# Altium schematic sheet [4] USB-PD Controller.SchDoc: Type-C and Sink Controller
size A3; Author: Caner ALP; Organization: ALP Electronics; Address1: Axel Oxenstiernas; Address2: Västerås; Address3: 72478; Address4: Sweden; DocumentNumber: 4; Revision: P0.1; SheetNumber: 4; SheetTotal: 7
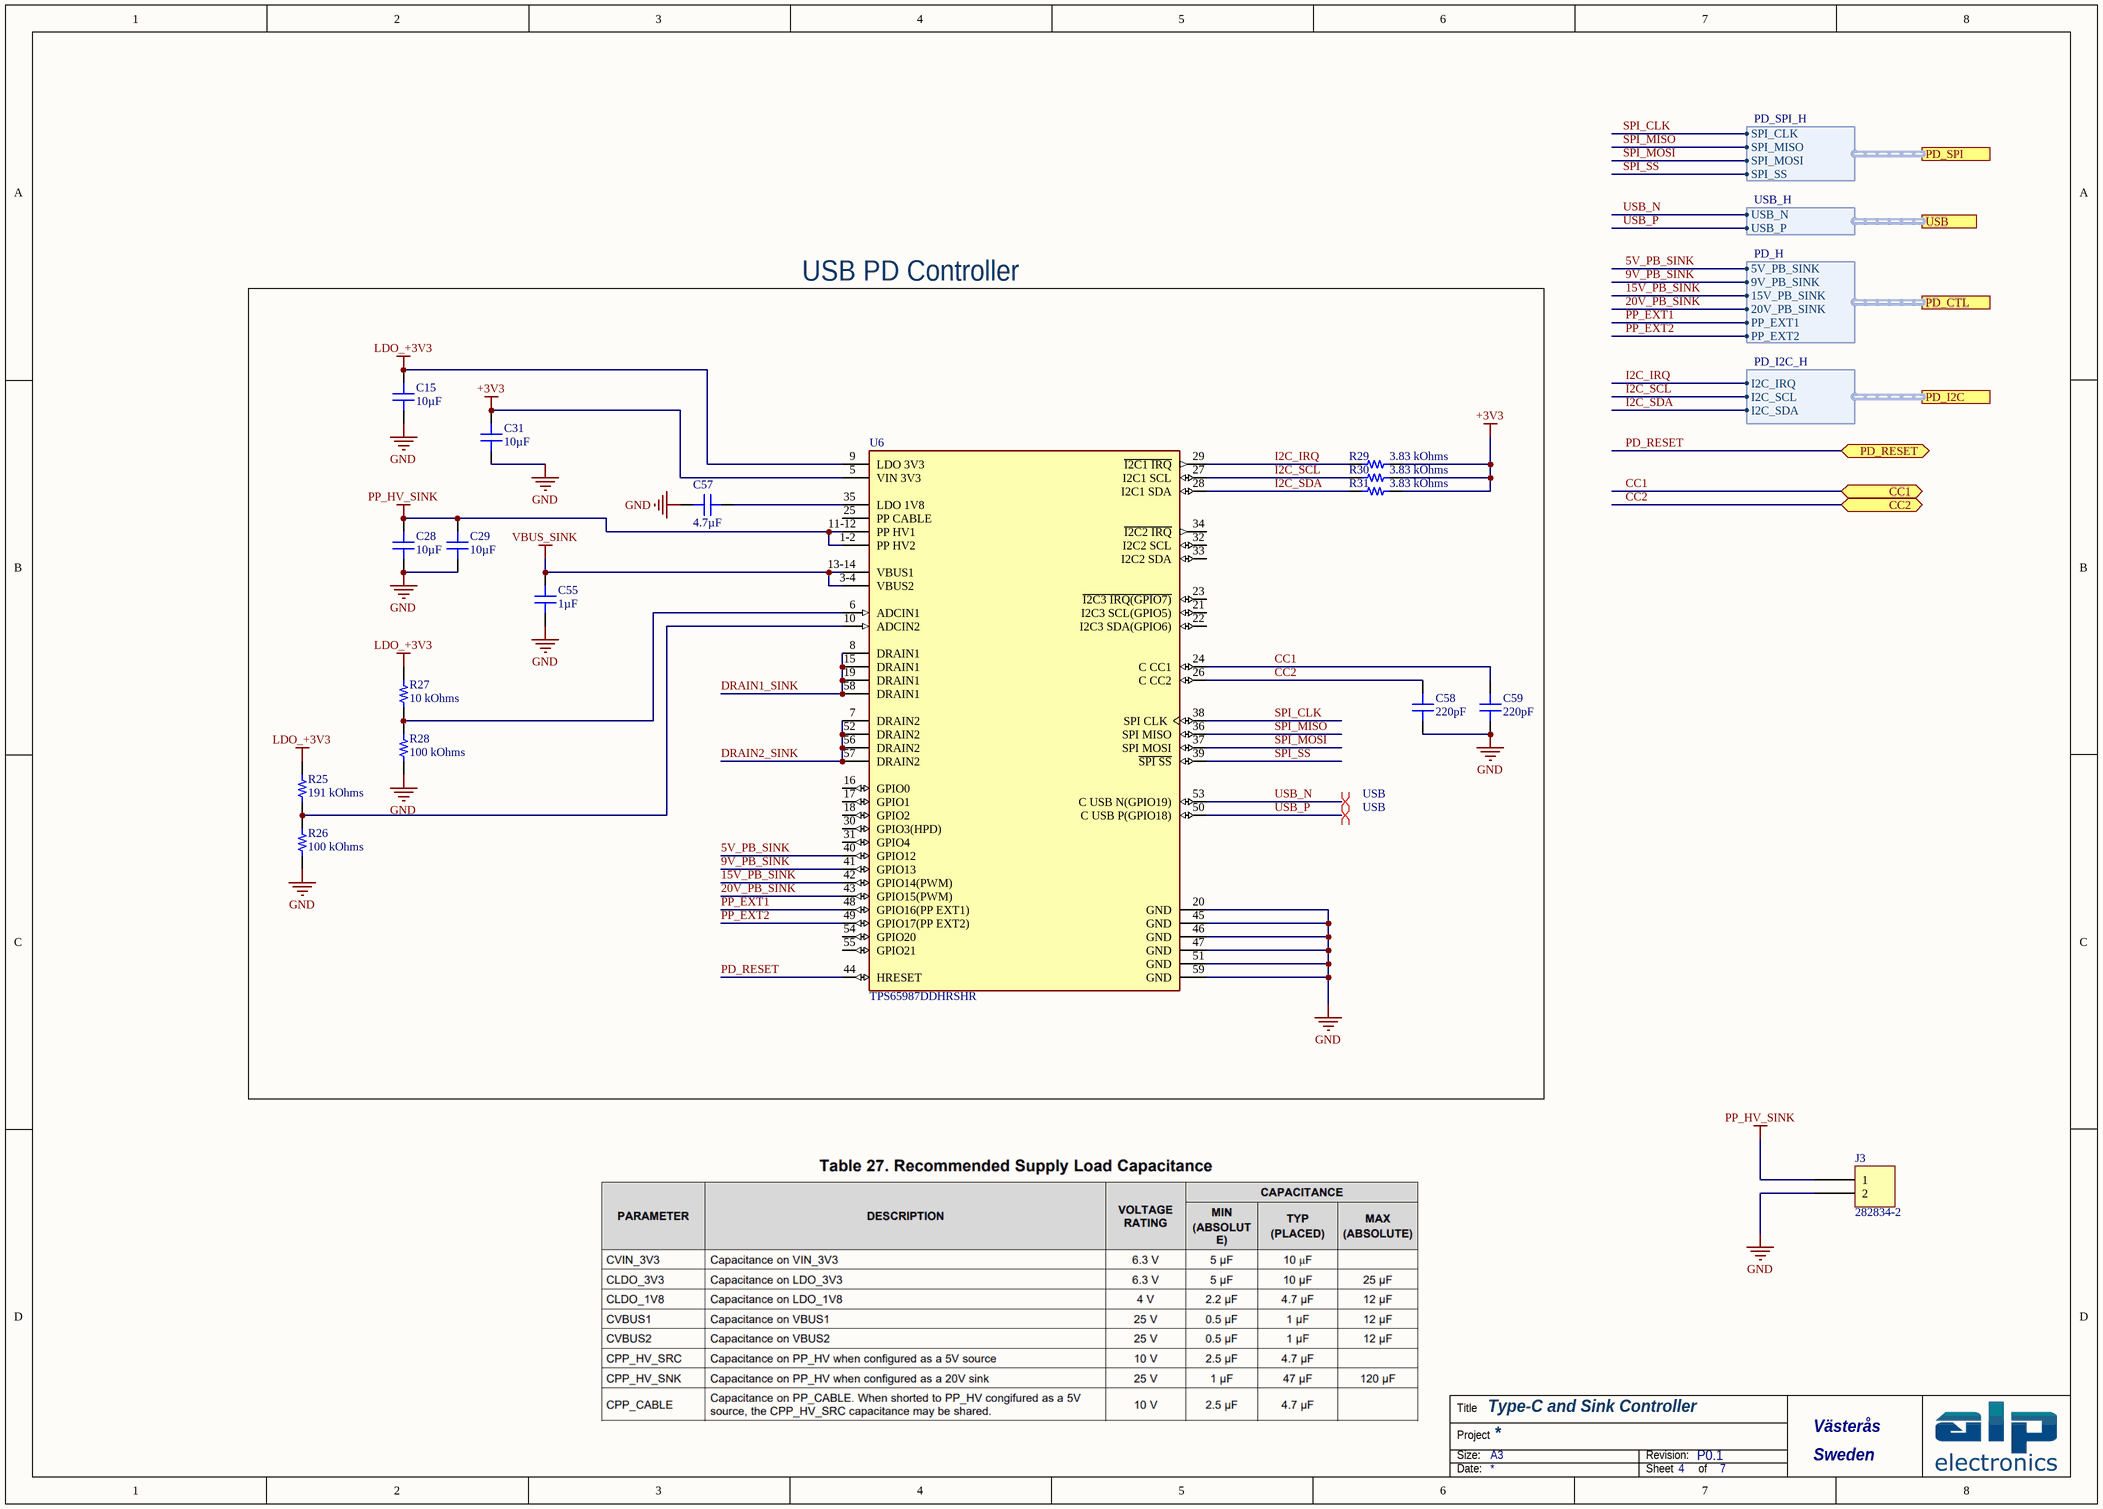
[diagram p0: [4] USB-PD Controller.SchDoc]

## Parts
C15  10µF  [CAP 0603_1608]
C28  10µF  [CAP 1206_3216 - 1.8MM]
C29  10µF  [CAP 1206_3216 - 1.8MM]
C31  10µF  [CAP 0603_1608]
C55  1µF  [CAP 1206_3216 - 0.8MM]
C57  4.7µF  [CAP 0603_1608]
C58  220pF  [CAP 0603_1608]
C59  220pF  [CAP 0603_1608]
J3  282834-2  [TE 282834-2]
R25  191 kOhms  [RES 0603_1608]
R26  100 kOhms  [RES 0603_1608]
R27  10 kOhms  [RES 0603_1608]
R28  100 kOhms  [RES 0603_1608]
R29  3.83 kOhms  [RES 0603_1608]
R30  3.83 kOhms  [RES 0603_1608]
R31  3.83 kOhms  [RES 0603_1608]
U6  TPS65987DDHRSHR  [FP-RSH0056E-MFG]

## Blocks framed on the sheet
USB PD Controller: C15 C28 C29 C31 C55 C57-C59 R25-R31 U6

## Ports
CC1 (bidir), CC2 (bidir), PD_CTL (harness PD_H), PD_I2C (harness PD_I2C_H), PD_RESET (bidir), PD_SPI (harness PD_SPI_H), USB (harness USB_H)

## Harnesses
PD_SPI_H: SPI_CLK, SPI_MISO, SPI_MOSI, SPI_SS
USB_H: USB_N, USB_P
PD_H: 5V_PB_SINK, 9V_PB_SINK, 15V_PB_SINK, 20V_PB_SINK, PP_EXT1, PP_EXT2
PD_I2C_H: I2C_IRQ, I2C_SCL, I2C_SDA

## Nets
+3V3: C31.2 R29.1 R30.1 R31.1 U6.5(VIN_3V3)
GND: C15.1 C28.1 C29.1 C31.1 C55.1 C57.2 C58.1 C59.1 J3.2 R26.1 R28.1 U6.20(GND) U6.45(GND) U6.46(GND) U6.47(GND) U6.51(GND) U6.59(GND)
LDO_+3V3: C15.2 R25.2 R27.1 U6.9(LDO_3V3)
PP_HV_SINK: C28.2 C29.2 J3.1 U6.1-2(PP_HV2) U6.11-12(PP_HV1)
VBUS_SINK: C55.2 U6.3-4(VBUS2) U6.13-14(VBUS1)
5V_PB_SINK: U6.40(GPIO12) ; port PD_CTL.5V_PB_SINK
9V_PB_SINK: U6.41(GPIO13) ; port PD_CTL.9V_PB_SINK
15V_PB_SINK: U6.42(GPIO14(PWM)) ; port PD_CTL.15V_PB_SINK
20V_PB_SINK: U6.43(GPIO15(PWM)) ; port PD_CTL.20V_PB_SINK
CC1: C59.2 U6.24(C_CC1) ; port CC1
CC2: C58.2 U6.26(C_CC2) ; port CC2
DRAIN1_SINK: U6.8(DRAIN1) U6.15(DRAIN1) U6.19(DRAIN1) U6.58(DRAIN1)
DRAIN2_SINK: U6.7(DRAIN2) U6.52(DRAIN2) U6.56(DRAIN2) U6.57(DRAIN2)
I2C_IRQ: R29.2 U6.29(~{I2C1_IRQ}) ; port PD_I2C.I2C_IRQ
I2C_SCL: R30.2 U6.27(I2C1_SCL) ; port PD_I2C.I2C_SCL
I2C_SDA: R31.2 U6.28(I2C1_SDA) ; port PD_I2C.I2C_SDA
PD_RESET: U6.44(HRESET) ; port PD_RESET
PP_EXT1: U6.48(GPIO16(PP_EXT1)) ; port PD_CTL.PP_EXT1
PP_EXT2: U6.49(GPIO17(PP_EXT2)) ; port PD_CTL.PP_EXT2
SPI_CLK: U6.38(SPI_CLK) ; port PD_SPI.SPI_CLK
SPI_MISO: U6.36(SPI_MISO) ; port PD_SPI.SPI_MISO
SPI_MOSI: U6.37(SPI_MOSI) ; port PD_SPI.SPI_MOSI
SPI_SS: U6.39(~{SPI_SS}) ; port PD_SPI.SPI_SS
USB_N: U6.53(C_USB_N(GPIO19)) ; port USB.USB_N
USB_P: U6.50(C_USB_P(GPIO18)) ; port USB.USB_P
NetC57_1: C57.1 U6.35(LDO_1V8)
NetR25_1: R25.1 R26.2 U6.10(ADCIN2)
NetR27_2: R27.2 R28.2 U6.6(ADCIN1)

Not connected (* = marked no-connect by the designer): U6 16(GPIO0) 17(GPIO1) 18(GPIO2) 21(I2C3_SCL(GPIO5)) 22(I2C3_SDA(GPIO6)) 23(~{I2C3_IRQ(GPIO7)}) 25(PP_CABLE) 30(GPIO3(HPD)) 31(GPIO4) 32(I2C2_SCL) 33(I2C2_SDA) 34(~{I2C2_IRQ}) 54(GPIO20) 55(GPIO21)

## Layout directives
differential pair; differential pair class USB: USB_N, USB_P

## Notes on the sheet
- Title
- Size:
- Project
- A3
- Revision:
- Date:
- Sheet
- of

## Library data of the parts
C15 C31 = 0603ZD106KAT2A: CAP CER 10UF 10V X5R 0603; Manufacturer: AVX Corporation; Tolerance: ±10%; Part Number: 0603ZD106KAT2A; Value: 10µF; Applications: General Purpose; Capacitance: 10µF; ComponentLink1Description: Datasheet; ComponentLink1URL: http://datasheets.avx.com/cx5r.pdf; ComponentLink2Description: DigiKey Link; ComponentLink2URL: http://digikey.com/product-detail/en/avx-corporation/0603ZD106KAT2A/478-10766-1-ND/7536554; Device Package: 0603 (1608 Metric); LastUpdated: 21/01/2020 00:02:09; Lifecycle Status: Active; Minimum Order: 1; Mounting Type: Surface Mount, MLCC; Operating Temperature: -55°C ~ 85°C; Package / Case: 0603 (1608 Metric); Packaging: TapeAndReel; PartId: 2590; Part Status: Active; Price: 0.09; Series: -; Size / Dimension: 0.063" L x 0.032" W (1.60mm x 0.81mm); Supplier 1: DigiKey; Supplier Part Number 1: 478-10766-1-ND; Temperature Coefficient: X5R; Thickness (Max): 0.037" (0.94mm); Voltage - Rated: 10V
C28 C29 = 1206BB106K250NGX072T: CAP CER 10UF 25V X7R 1206; Manufacturer: Knowles Novacap; Tolerance: ±10%; Part Number: 1206BB106K250NGX072T; Value: 10µF; Applications: General Purpose; Capacitance: 10µF; ComponentLink1Description: Datasheet; ComponentLink1URL: https://www.knowlescapacitors.com/getattachment/6c8d48ef-fc2b-4752-ae2c-ce6c208de0c4/High-Capacitance-Chip.aspx; ComponentLink2Description: DigiKey Link; ComponentLink2URL: http://digikey.com/product-detail/en/knowles-novacap/1206BB106K250NGX072T/1763-1135-1-ND/7304039; Device Package: 1206 (3216 Metric); Features: Gold Flash Termination; LastUpdated: 21/01/2020 00:03:35; Lifecycle Status: Active; Minimum Order: 1; Mounting Type: Surface Mount, MLCC; Operating Temperature: -55°C ~ 125°C; Package / Case: 1206 (3216 Metric); Packaging: TapeAndReel; PartId: 22718; Part Status: Active; Price: 1.95; Series: -; Size / Dimension: 0.125" L x 0.060" W (3.18mm x 1.52mm); Supplier 1: DigiKey; Supplier Part Number 1: 1763-1135-1-ND; Temperature Coefficient: X7R; Thickness (Max): 0.064" (1.63mm); Voltage - Rated: 25V
C55 = AC1206KKX7R8BB105: CAP CER 1UF 25V X7R 1206; Manufacturer: Yageo; Tolerance: ±10%; Part Number: AC1206KKX7R8BB105; Value: 1µF; Applications: Automotive; Capacitance: 1µF; ComponentLink1Description: Datasheet; ComponentLink1URL: http://www.yageo.com/documents/recent/UPY-AC_NP0X7R_16V-to-630V_12.pdf; ComponentLink2Description: DigiKey Link; ComponentLink2URL: http://digikey.com/product-detail/en/yageo/AC1206KKX7R8BB105/311-3039-1-ND/6643290; Device Package: 1206 (3216 Metric); LastUpdated: 21/01/2020 00:03:07; Lifecycle Status: Active; Minimum Order: 1; Mounting Type: Surface Mount, MLCC; Operating Temperature: -55°C ~ 125°C; Package / Case: 1206 (3216 Metric); Packaging: TapeAndReel; PartId: 18820; Part Status: Active; Price: 0.22; Ratings: AEC-Q200; Series: AC; Size / Dimension: 0.126" L x 0.063" W (3.20mm x 1.60mm); Supplier 1: DigiKey; Supplier Part Number 1: 311-3039-1-ND; Temperature Coefficient: X7R; Thickness (Max): 0.028" (0.70mm); Voltage - Rated: 25V
C57 = 0603ZD475KAT2A: CAP CER 4.7UF 10V X5R 0603; Manufacturer: AVX Corporation; Tolerance: ±10%; Part Number: 0603ZD475KAT2A; Value: 4.7µF; Applications: General Purpose; Capacitance: 4.7µF; ComponentLink1Description: Datasheet; ComponentLink1URL: http://datasheets.avx.com/cx5r.pdf; ComponentLink2Description: DigiKey Link; ComponentLink2URL: http://digikey.com/product-detail/en/avx-corporation/0603ZD475KAT2A/478-7943-1-ND/3881566; Device Package: 0603 (1608 Metric); LastUpdated: 21/01/2020 00:01:36; Lifecycle Status: Active; Minimum Order: 1; Mounting Type: Surface Mount, MLCC; Operating Temperature: -55°C ~ 85°C; Package / Case: 0603 (1608 Metric); PartId: 18469; Part Status: Active; Price: 0; Series: -; Size / Dimension: 0.063" L x 0.032" W (1.60mm x 0.81mm); Supplier 1: DigiKey; Supplier Part Number 1: 478-7943-1-ND; Temperature Coefficient: X5R; Thickness (Max): 0.035" (0.90mm); Voltage - Rated: 10V
C58 C59 = 500R14N221JV4T: CAP CER 220PF 50V C0G/NP0 0603; Manufacturer: Johanson Dielectrics Inc.; Temperature Coefficient: C0G, NP0; Tolerance: ±5%; Part Number: 500R14N221JV4T; Value: 220pF; Applications: General Purpose; Capacitance: 220pF; ComponentLink1Description: Datasheet; ComponentLink1URL: https://www.johansondielectrics.com/downloads/catalog/johanson-dielectrics-product-catalog.pdf; ComponentLink2Description: DigiKey Link; ComponentLink2URL: http://digikey.com/product-detail/en/johanson-dielectrics-inc/500R14N221JV4T/709-1148-1-ND/1859480; Device Package: 0603 (1608 Metric); LastUpdated: 21/01/2020 00:01:54; Lifecycle Status: Active; Minimum Order: 1; Mounting Type: Surface Mount, MLCC; Operating Temperature: -55°C ~ 125°C; Package / Case: 0603 (1608 Metric); Packaging: TapeAndReel; PartId: 11524; Part Status: Active; Price: 0.03; Series: -; Size / Dimension: 0.063" L x 0.032" W (1.60mm x 0.81mm); Supplier 1: DigiKey; Supplier Part Number 1: 709-1148-1-ND; Thickness (Max): 0.035" (0.89mm); Voltage - Rated: 50V
J3 = 282834-2: TERM BLK 2P SIDE ENT 2.54MM PCB; Manufacturer: TE Connectivity AMP Connectors; Current: 10A; Mating Orientation: Horizontal with Board; Number of Levels: 1; Pitch: 0.100" (2.54mm); Positions Per Level: 2; Voltage: 150V; Wire Gauge: 16-30 AWG; Wire Termination: Screw - Rising Cage Clamp; Part Number: 282834-2; Color: Green; ComponentLink1Description: Datasheet; ComponentLink1URL: https://www.te.com/commerce/DocumentDelivery/DDEController?Action=srchrtrv&DocNm=282834&DocType=Customer+Drawing&DocLang=English; ComponentLink2Description: DigiKey Link; ComponentLink2URL: http://digikey.com/product-detail/en/te-connectivity-amp-connectors/282834-2/A98333-ND/1150135; LastUpdated: 15/01/2020 04:15:38; Lifecycle Status: Active; Minimum Order: 1; Mounting Type: Through Hole; Packaging: Bulk; Part Status: Active; Price: 0.88; Series: Buchanan; Supplier 1: DigiKey; Supplier Part Number 1: A98333-ND
R25 = RC0603FR-07191KL: RES SMD 191K OHM 1% 1/10W 0603; Manufacturer: Yageo; Power (Watts): 0.1W, 1/10W; Temperature Coefficient: ±100ppm/°C; Part Number: RC0603FR-07191KL; Value: 191 kOhms; ComponentLink1Description: Datasheet; ComponentLink1URL: https://www.yageo.com/upload/media/product/productsearch/datasheet/rchip/PYu-RC_Group_51_RoHS_L_10.pdf; ComponentLink2Description: DigiKey Link; ComponentLink2URL: http://digikey.com/product-detail/en/yageo/RC0603FR-07191KL/311-191KHRCT-ND/729952; Composition: Thick Film; Device Package: 0603 (1608 Metric); Features: Moisture Resistant; Height - Seated (Max): 0.022" (0.55mm); LastUpdated: 21/01/2020 00:23:46; Lifecycle Status: Active; Minimum Order: 1; Number of Terminations: 2; Operating Temperature: -55°C ~ 155°C; Package / Case: 0603 (1608 Metric); Packaging: CutTape; PartId: 7764; Part Status: Active; Price: 0.10; Resistance: 191 kOhms; Series: RC; Size / Dimension: 0.063" L x 0.031" W (1.60mm x 0.80mm); Supplier 1: DigiKey; Supplier Part Number 1: 311-191KHRCT-ND; Supplier Device Package: 0603; Tolerance: ±1%
R26 R28 = CRGH0603J100K: RES SMD 100K OHM 5% 1/5W 0603; Manufacturer: TE Connectivity Passive Product; Power (Watts): 0.2W, 1/5W; Temperature Coefficient: ±100ppm/°C; Part Number: CRGH0603J100K; Value: 100 kOhms; ComponentLink1Description: Datasheet; ComponentLink1URL: https://www.te.com/commerce/DocumentDelivery/DDEController?Action=srchrtrv&DocNm=1773204-1&DocType=DS&DocLang=English; ComponentLink2Description: DigiKey Link; ComponentLink2URL: http://digikey.com/product-detail/en/te-connectivity-passive-product/CRGH0603J100K/A126393CT-ND/7603448; Composition: Thick Film; Device Package: 0603 (1608 Metric); LastUpdated: 21/01/2020 00:15:56; Lifecycle Status: Active; Minimum Order: 1; Number of Terminations: 2; Operating Temperature: -55°C ~ 155°C; Package / Case: 0603 (1608 Metric); Packaging: TapeAndReel; PartId: 24648; Part Status: Active; Price: 0.01; Resistance: 100 kOhms; Series: CRGH, Neohm; Size / Dimension: 0.063" L x 0.031" W (1.60mm x 0.80mm); Supplier 1: DigiKey; Supplier Part Number 1: A126393CT-ND; Supplier Device Package: 0603; Tolerance: ±5%
R27 = CRCW060310K0JNEA: RES SMD 10K OHM 5% 1/10W 0603; Manufacturer: Vishay Dale; Power (Watts): 0.1W, 1/10W; Temperature Coefficient: ±200ppm/°C; Part Number: CRCW060310K0JNEA; Value: 10 kOhms; ComponentLink1Description: Datasheet; ComponentLink1URL: http://www.vishay.com/docs/20035/dcrcwe3.pdf; ComponentLink2Description: DigiKey Link; ComponentLink2URL: http://digikey.com/product-detail/en/vishay-dale/CRCW060310K0JNEA/541-10KGCT-ND/1179393; Composition: Thick Film; Device Package: 0603 (1608 Metric); Features: Automotive AEC-Q200; Height - Seated (Max): 0.020" (0.50mm); LastUpdated: 21/01/2020 00:24:50; Lifecycle Status: Active; Minimum Order: 1; Number of Terminations: 2; Operating Temperature: -55°C ~ 155°C; Package / Case: 0603 (1608 Metric); Packaging: CutTape; PartId: 5216; Part Status: Active; Price: 0.10; Ratings: AEC-Q200; Resistance: 10 kOhms; Series: CRCW; Size / Dimension: 0.063" L x 0.033" W (1.60mm x 0.85mm); Supplier 1: DigiKey; Supplier Part Number 1: 541-10KGCT-ND; Supplier Device Package: 0603; Tolerance: ±5%
R29-R31 = RC0603FR-073K83L: RES SMD 3.83K OHM 1% 1/10W 0603; Manufacturer: Yageo; Power (Watts): 0.1W, 1/10W; Temperature Coefficient: ±100ppm/°C; Part Number: RC0603FR-073K83L; Value: 3.83 kOhms; ComponentLink1Description: Datasheet; ComponentLink1URL: https://www.yageo.com/upload/media/product/productsearch/datasheet/rchip/PYu-RC_Group_51_RoHS_L_10.pdf; ComponentLink2Description: DigiKey Link; ComponentLink2URL: http://digikey.com/product-detail/en/yageo/RC0603FR-073K83L/311-3.83KHRCT-ND/730082; Composition: Thick Film; Device Package: 0603 (1608 Metric); Features: Moisture Resistant; Height - Seated (Max): 0.022" (0.55mm); LastUpdated: 21/01/2020 00:21:56; Lifecycle Status: Active; Minimum Order: 1; Number of Terminations: 2; Operating Temperature: -55°C ~ 155°C; Package / Case: 0603 (1608 Metric); Packaging: CutTape; PartId: 12460; Part Status: Active; Price: 0.10; Resistance: 3.83 kOhms; Series: RC; Size / Dimension: 0.063" L x 0.031" W (1.60mm x 0.80mm); Supplier 1: DigiKey; Supplier Part Number 1: 311-3.83KHRCT-ND; Supplier Device Package: 0603; Tolerance: ±1%
U6 = CMP-04910-000002-1: ACELITE 88 ROM 1.6 PROTO 7X7; Manufacturer: Texas Instruments; Standoff Height: 0mm; Number Of Outputs: 1; Min Supply Voltage: 3.135V; Max Junction Temp: +125°C; Nominal Supply Current: 5-8mA; Max Supply Voltage: 3.45V; Output Voltage: 3.3V; Automotive: No; Manufacturer Part Number: TPS65987DDHRSHR; ComponentLink2Description: Datasheet; RoHS: TRUE; Height: 1mm; ComponentLink2URL: http://www.ti.com/lit/ds/symlink/tps65987d.pdf; Ambient Temperature Range High: +75°C; Digikey Description: ACELITE 88 ROM 1.6 PROTO 7X7; Category: IC; Octopart: https://octopart.com/tps65987ddhrshr-texas+instruments-92191376; Device Class L3: unset; Temperature Range Low: -10°C; Device Class L2: Power Management ICs; Temperature: -10°C to +75°C; Ambient Temperature Range Low: -10°C; Temperature Range High: +75°C; Lead Free: Yes; Device Class L1: Integrated Circuits (ICs); Package: RSH0056E